# EasyEDA schematic SCH_sine-wave-generator_2024-02-24.json
TITLE: Sheet_1; REV: 1.0; Date: 2024-02-07; Sheet: 1/1; Company: Your Company
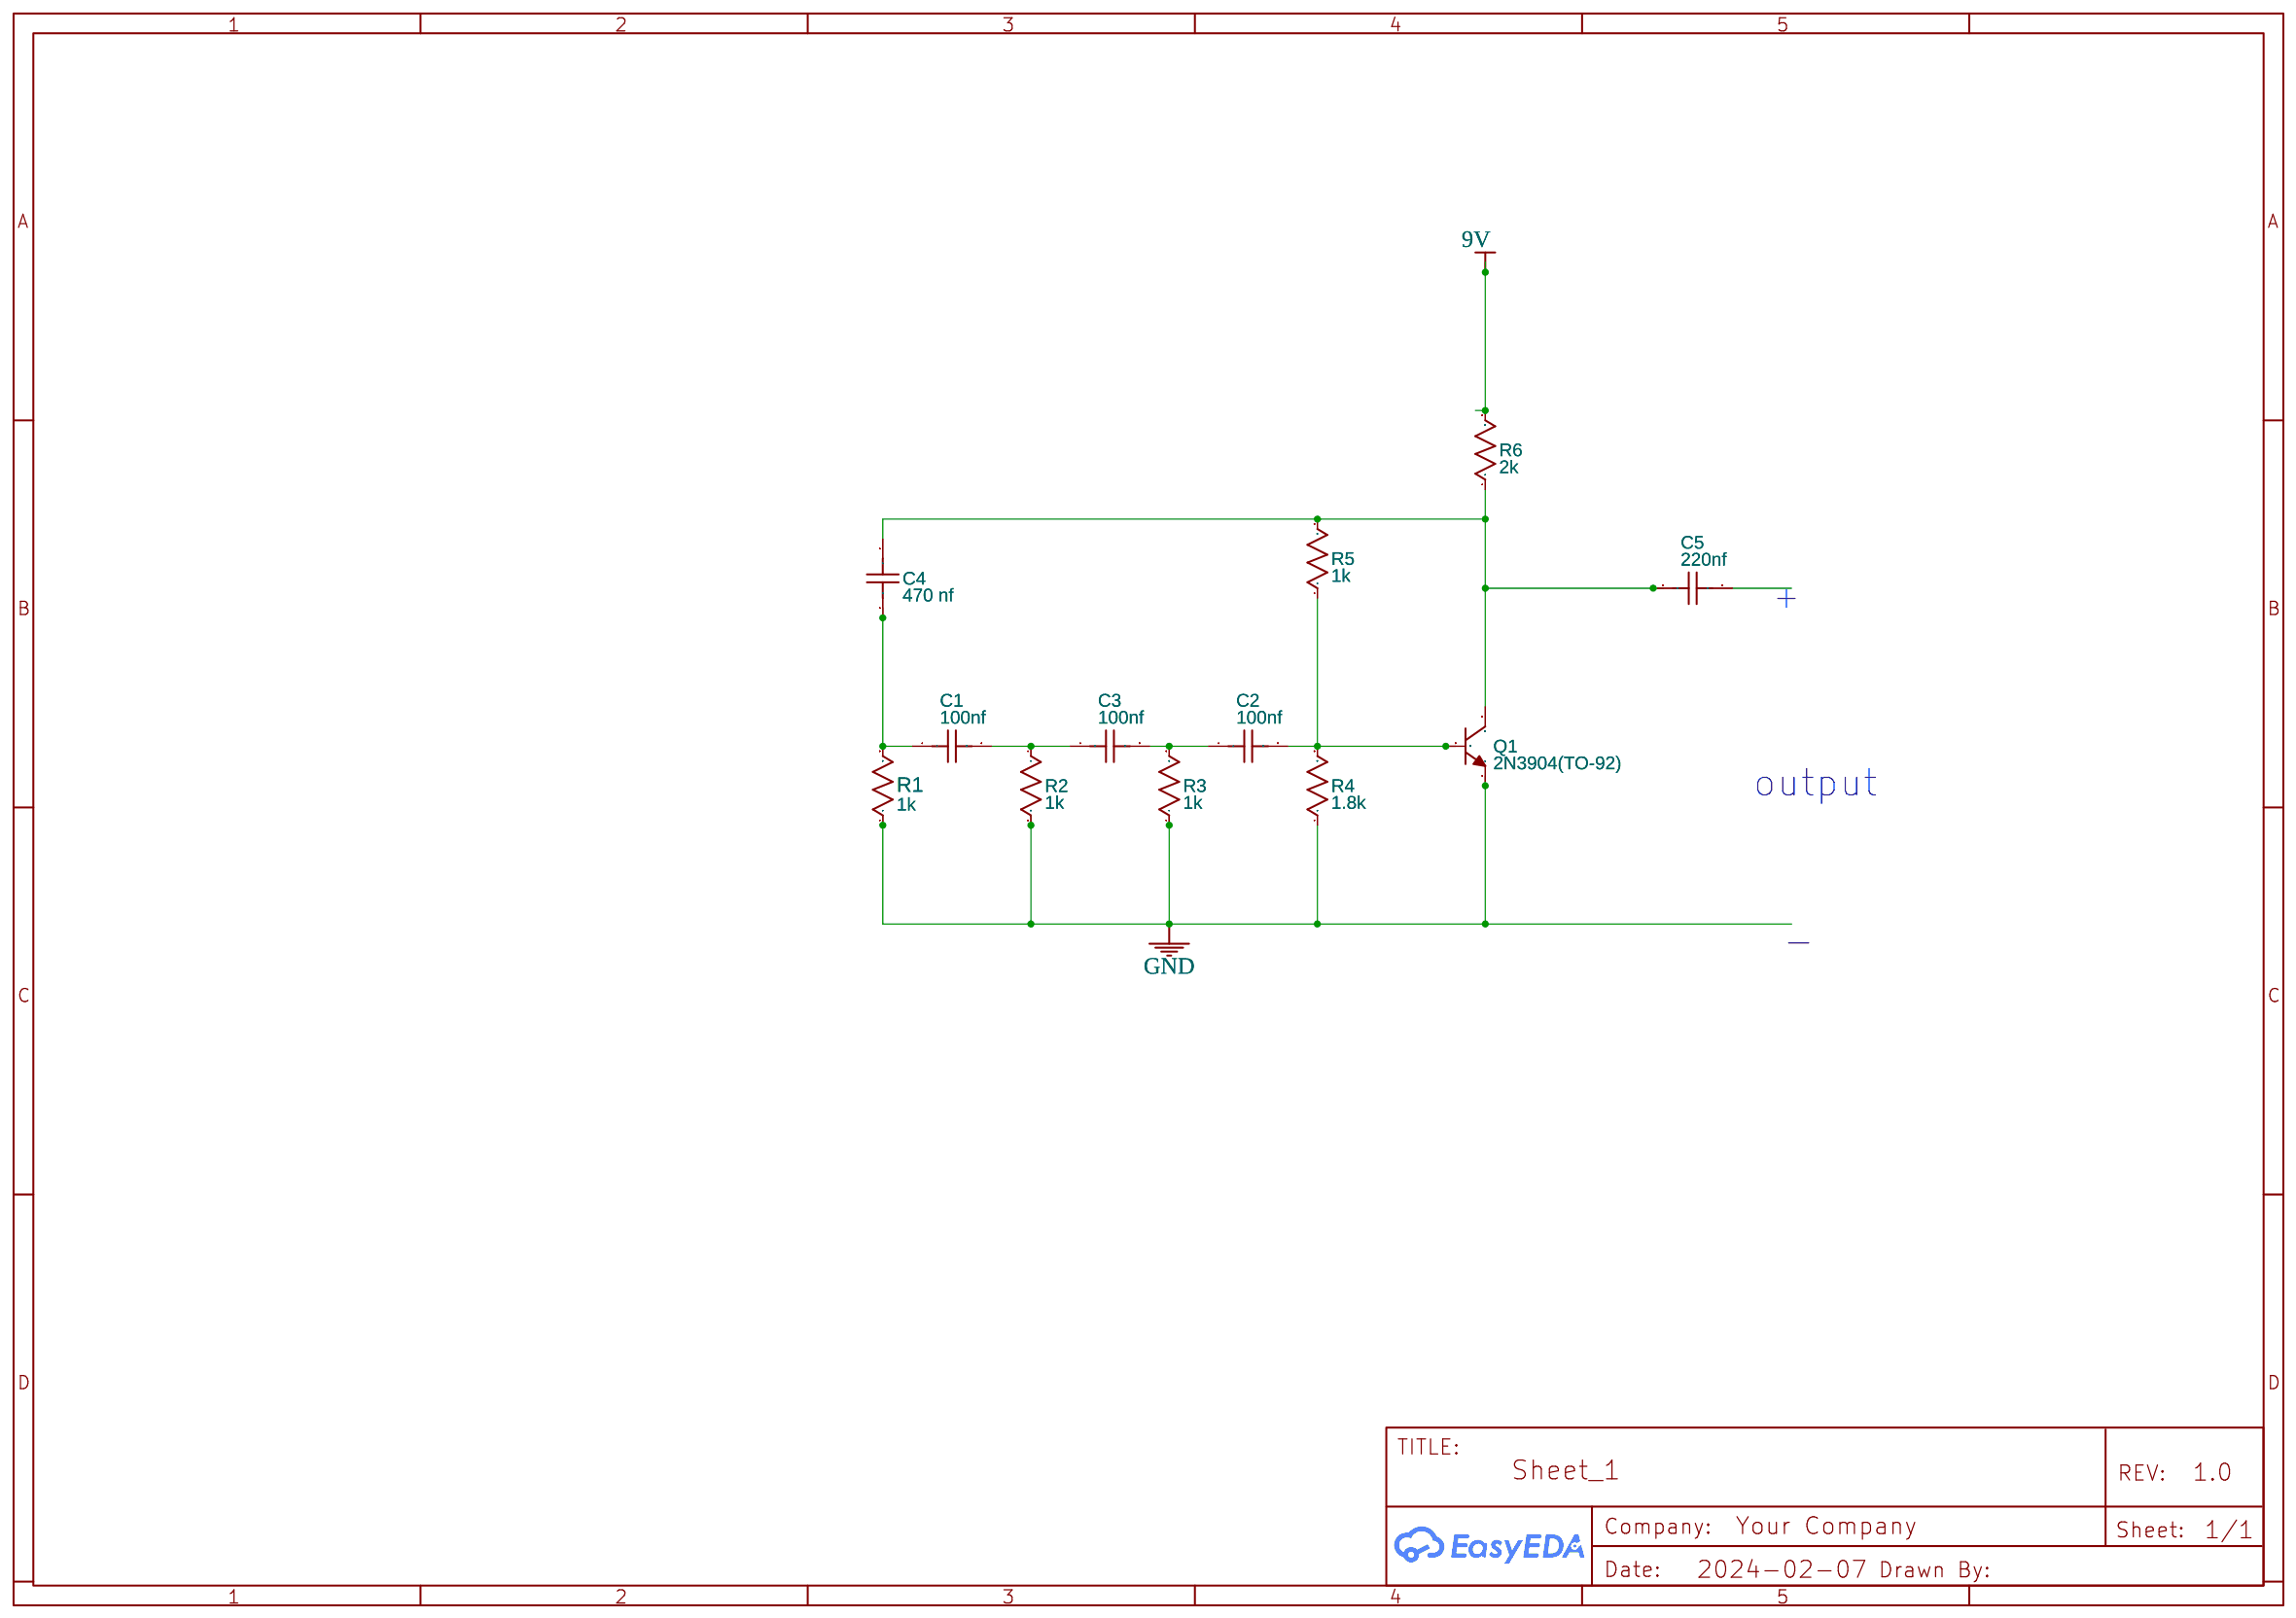
[diagram p0: schematic sheet]

## Parts
C1  100nf  [C0603]
C2  100nf  [C0603]
C3  100nf  [C0603]
C4  470 nf  [C0603]
C5  220nf  [C0603]
Q1  2N3904(TO-92)  [TO-92-3_L5.1-W4.1-P1.27-L]
R1  1k  [R0603]
R2  1k  [R0603]
R3  1k  [R0603]
R4  1.8k  [R0603]
R5  1k  [R0603]
R6  2k  [R0603]

## Library data of the parts
C1-C5 = C_0603_US: Contributor: LCEDA_Lib
Q1 = 2N3904(TO-92): Supplier: LCSC; Manufacturer: SEMTECH; Manufacturer Part: 2N3904; Supplier Part: C118538; Contributor: LCEDA_Lib
R1-R6 = R_0603_US: Contributor: LCEDA_Lib

## Nets
9V: R6.2
GND: Q1.1(E) R1.1 R2.2 R3.1 R4.1
Net-(C1-1): C1.1 C4.1 R1.2
Net-(C1-2): C1.2 C3.1 R2.1
Net-(C2-1): C2.1 C3.2 R3.2
Net-(C2-2): C2.2 Q1.2(B) R4.2 R5.1
Net-(C4-2): C4.2 C5.2 Q1.3(C) R5.2 R6.1

Not connected (* = marked no-connect by the designer): C5 1

## Notes on the sheet
- +
- output
- -
